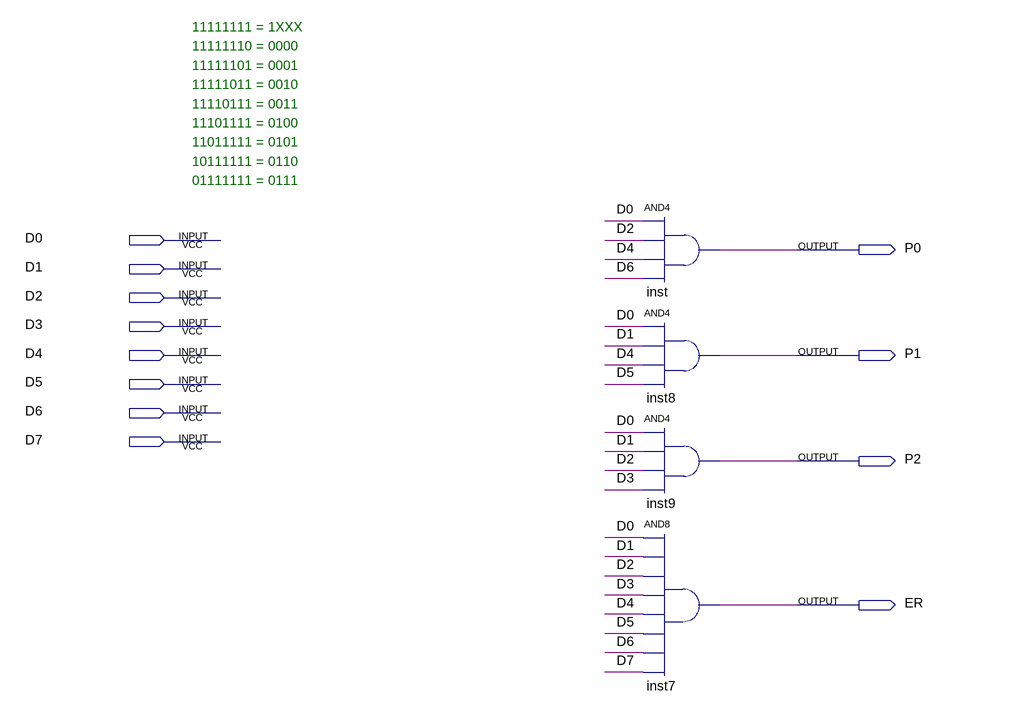
[diagram p0: schematic sheet]
// Quartus schematic Decoder_Out_8.bdf as structural Verilog: 4 symbols, 12 pins
module Decoder_Out_8 (
  input  D0,
  input  D1,
  input  D2,
  input  D3,
  input  D4,
  input  D5,
  input  D6,
  input  D7,
  output P0,
  output P1,
  output P2,
  output ER
);

  and inst (P0, D0, D2, D4, D6);
  and inst8 (P1, D0, D1, D4, D5);
  and inst9 (P2, D0, D1, D2, D3);
  and inst7 (ER, D0, D1, D2, D3, D4, D5, D6, D7);

  // Notes on the sheet:
  //   11111111 = 1XXX
  //   11111110 = 0000
  //   11111101 = 0001
  //   11111011 = 0010
  //   11110111 = 0011
  //   11101111 = 0100
  //   11011111 = 0101
  //   10111111 = 0110
  //   01111111 = 0111
endmodule
